# EAGLE schematic vvm-visitorcounter (EAGLE 7.3.0)
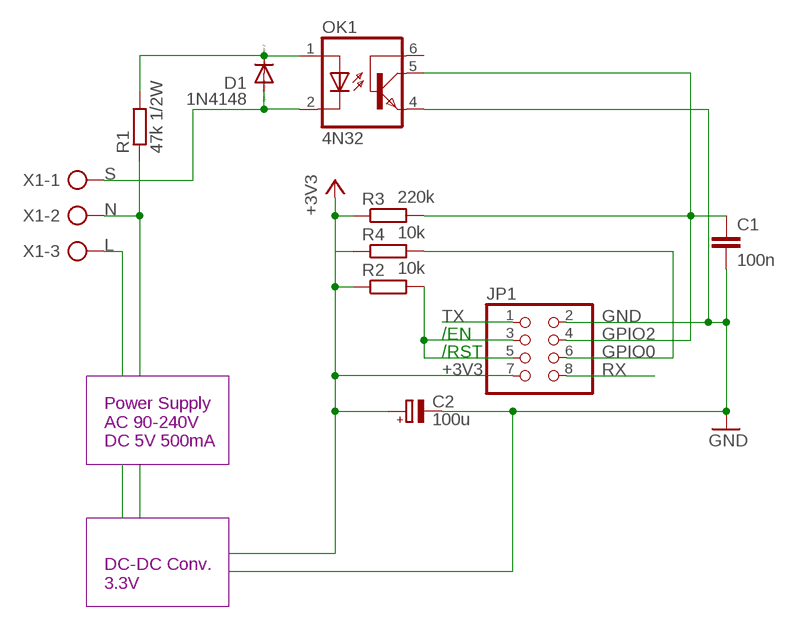
[diagram p0: schematic, sheet 1]

## Parts
C1  100n  C-EU050-025X075  [C050-025X075]
C2  100u  CPOL-EUE2-5  [E2-5]
D1  1N4148  1N4148DO35-7  [DO35-7]
JP1  PINHD-2X4  [2X04]
OK1  4N32  4N25M  [DIL06]
R1  47k 1/2W  R-EU_0207/10  [0207/10]
R2  10k  R-EU_0207/10  [0207/10]
R3  220k  R-EU_0207/10  [0207/10]
R4  10k  R-EU_0207/10  [0207/10]
X1  AK300/3  [AK300/3]

## Nets
+3V3: C2.+ JP1.7 R2.1 R3.1 R4.1
GND: C1.2 C2.- JP1.2 OK1.4(EMI)
GPIO0: JP1.6 R4.2
GPIO2: C1.1 JP1.4 OK1.5(COL) R3.2
L: X1.3
N: R1.1 X1.2
N$1: D1.C OK1.1(A) R1.2
N$5: JP1.3 JP1.5 R2.2
RX: JP1.8
S: D1.A OK1.2(C) X1.1
TX: JP1.1
Unconnected: OK1.6(BAS)

## Notes on the sheet
- /EN
- /RST
- Power Supply
  AC 90-240V
  DC 5V 500mA
- DC-DC Conv.
  3.3V

## Library data of the parts
C1 = rcl:C-EU: CAPACITOR, European symbol
C2 = rcl:CPOL-EU: POLARIZED CAPACITOR, European symbol
D1 = diode:1N4148: DIODE high speed (Philips)
JP1 = pinhead:PINHD-2X4: PIN HEADER
OK1 = optocoupler:4N*?M: General Purpose 6-Pin Phototransistor Optocouplers Source: http://www.fairchildsemi.com/ds/4N/4N35-M.pdf; MPN: 4N25-M; OC_FARNELL: 1021349; OC_NEWARK: 98K9084
R1-R4 = rcl:R-EU_: RESISTOR, European symbol
X1 = con-ptr500:AK300/3: CONNECTOR; OC_FARNELL: unknown; OC_NEWARK: unknown